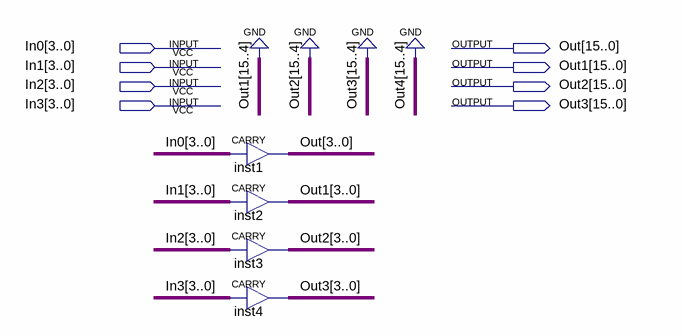
[diagram p0: schematic sheet]
// Quartus schematic SignExtend_4bit_to_16bit_Design.bdf as structural Verilog: 4 symbols, 8 pins
module SignExtend_4bit_to_16bit_Design (
  input  [3:0] In0,
  input  [3:0] In1,
  input  [3:0] In2,
  input  [3:0] In3,
  output [15:0] Out,
  output [15:0] Out1,
  output [15:0] Out2,
  output [15:0] Out3
);

  CARRY inst1[3:0] (.IN(In0), .OUT(Out[3:0]));
  CARRY inst2[3:0] (.IN(In1), .OUT(Out1[3:0]));
  CARRY inst3[3:0] (.IN(In2), .OUT(Out2[3:0]));
  CARRY inst4[3:0] (.IN(In3), .OUT(Out3[3:0]));

  assign Out1[15:4] = {12{1'b0}};
  assign Out2[15:4] = {12{1'b0}};
  assign Out3[15:4] = {12{1'b0}};
endmodule
